# EAGLE design RevA (EAGLE 7.3.0)
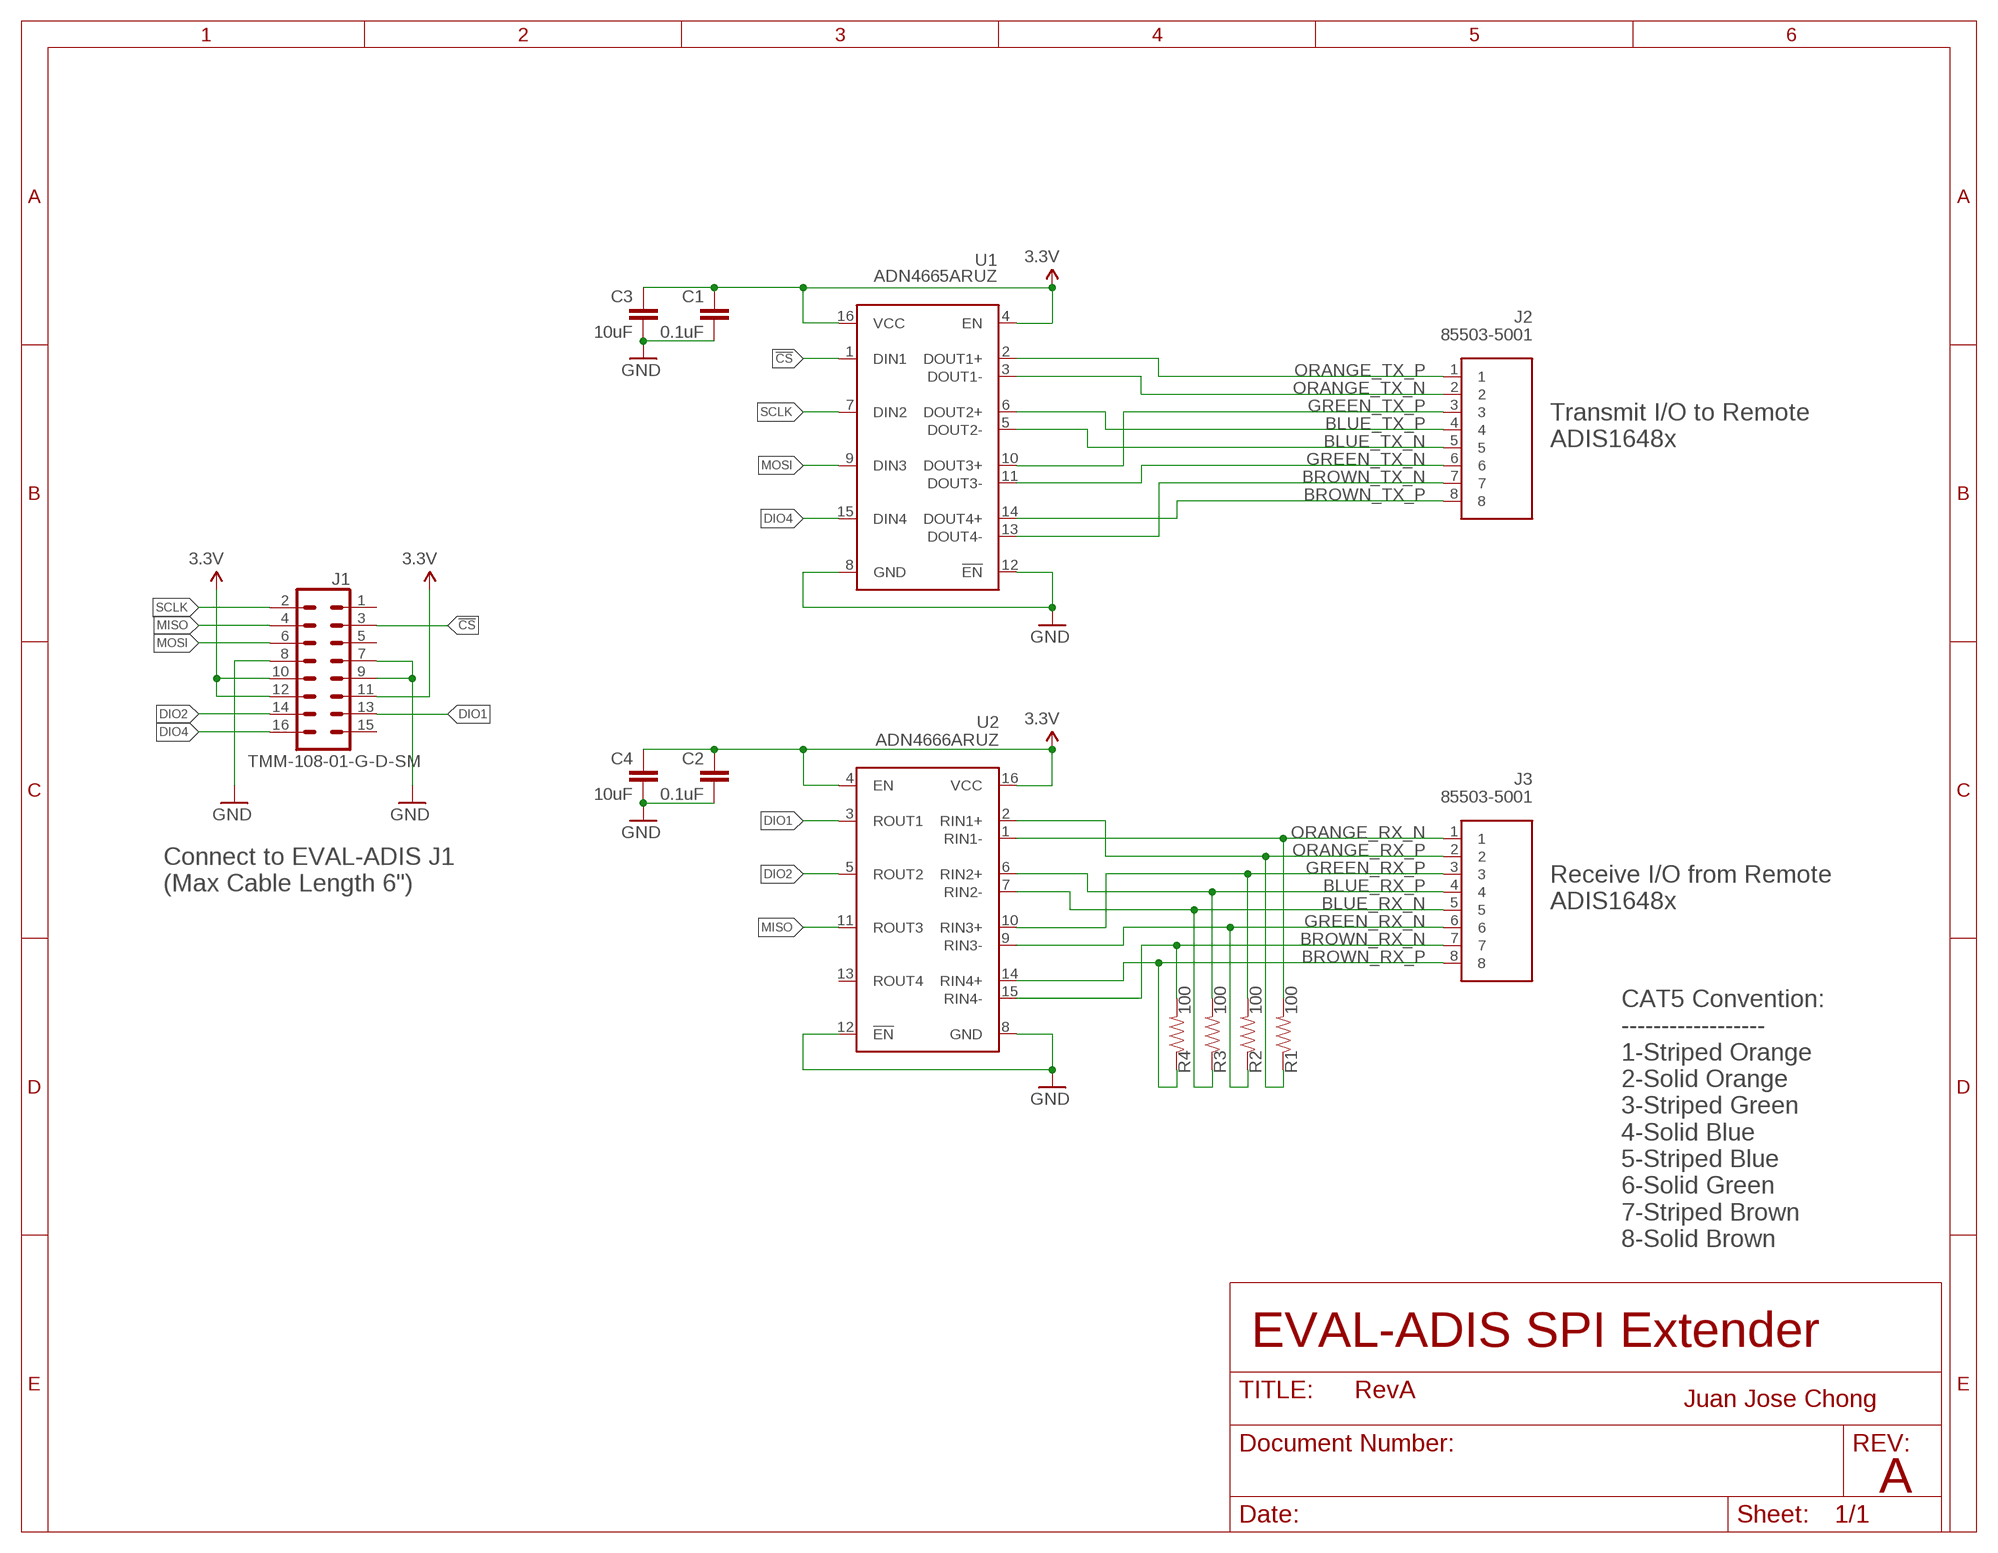
[diagram p0: schematic, sheet 1]

## Parts
C1  0.1uF  CAP0805  [0805]
C2  0.1uF  CAP0805  [0805]
C3  10uF  CAP1206  [1206]
C4  10uF  CAP1206  [1206]
J1  TMM-108-01-G-D-SM  TMM-108-XX-X-D  [TMM-108-XX-X-D]
J2  85503-5001  [85503-5001]
J3  85503-5001  [85503-5001]
R1  100  RESISTOR0603-RES  [0603-RES]
R2  100  RESISTOR0603-RES  [0603-RES]
R3  100  RESISTOR0603-RES  [0603-RES]
R4  100  RESISTOR0603-RES  [0603-RES]
U1  ADN4665ARUZ  [TSSOP-16]
U2  ADN4666ARUZ  [TSSOP-16]

## Nets
3.3V: C1.1 C2.1 C3.1 C4.1 J1.10 J1.11 J1.12 U1.4(EN) U1.16(VCC) U2.4(EN) U2.16(VCC)
!CS: J1.3 U1.1(DIN1)
BLUE_RX_N: J3.5 R3.1 U2.7(RIN2-)
BLUE_RX_P: J3.4 R3.2 U2.6(RIN2+)
BLUE_TX_N: J2.5 U1.5(DOUT2-)
BLUE_TX_P: J2.4 U1.6(DOUT2+)
BROWN_RX_N: J3.7 R4.2 U2.15(RIN4-)
BROWN_RX_P: J3.8 R4.1 U2.14(RIN4+)
BROWN_TX_N: J2.7 U1.13(DOUT4-)
BROWN_TX_P: J2.8 U1.14(DOUT4+)
DIO1: J1.13 U2.3(ROUT1)
DIO2: J1.14 U2.5(ROUT2)
DIO4: J1.16 U1.15(DIN4)
GND: C1.2 C2.2 C3.2 C4.2 J1.7 J1.8 J1.9 U1.8(GND) U1.12(!EN) U2.8(GND) U2.12(!EN)
GREEN_RX_N: J3.6 R2.1 U2.9(RIN3-)
GREEN_RX_P: J3.3 R2.2 U2.10(RIN3+)
GREEN_TX_N: J2.6 U1.11(DOUT3-)
GREEN_TX_P: J2.3 U1.10(DOUT3+)
MISO: J1.4 U2.11(ROUT3)
MOSI: J1.6 U1.9(DIN3)
ORANGE_RX_N: J3.1 R1.2 U2.1(RIN1-)
ORANGE_RX_P: J3.2 R1.1 U2.2(RIN1+)
ORANGE_TX_N: J2.2 U1.3(DOUT1-)
ORANGE_TX_P: J2.1 U1.2(DOUT1+)
SCLK: J1.2 U1.7(DIN2)
Unconnected: J1.1 J1.5 J1.15 U2.13(ROUT4)

## Notes on the sheet
- Transmit I/O to Remote
  ADIS1648x
- Connect to EVAL-ADIS J1
  (Max Cable Length 6")
- Receive I/O from Remote
  ADIS1648x
- CAT5 Convention:
  ------------------
  1-Striped Orange
  2-Solid Orange
  3-Striped Green
  4-Solid Blue
  5-Striped Blue
  6-Solid Green
  7-Striped Brown
  8-Solid Brown
- EVAL-ADIS SPI Extender
- Juan Jose Chong
- A

## Library data of the parts
C1 C2 = SparkFun-Passives:CAP: Capacitor Standard 0603 ceramic capacitor, and 0.1" leaded capacitor.; PARTNO: CL10B104KB8NNNC
C3 C4 = SparkFun-Passives:CAP: Capacitor Standard 0603 ceramic capacitor, and 0.1" leaded capacitor.; PARTNO: F931C106MAA
J1 = con-samtec-tmm:TMM-108-XX-X-D: HEADER; PARTNO: TMM-108-01-G-D-SM
J2 J3 = AnalogDevices:85503-5001; PARTNO: 855035001
R1-R4 = SparkFun-Passives:RESISTOR: Resistor Basic schematic elements and footprints for 0603, 1206, and PTH resistors.; PARTNO: ERJ-3EKF1000V
U1 = Analog Devices iSensors:ADN4665; PARTNO: ADN4665ARUZ
U2 = Analog Devices iSensors:ADN4666; PARTNO: ADN4666ARUZ

## Board
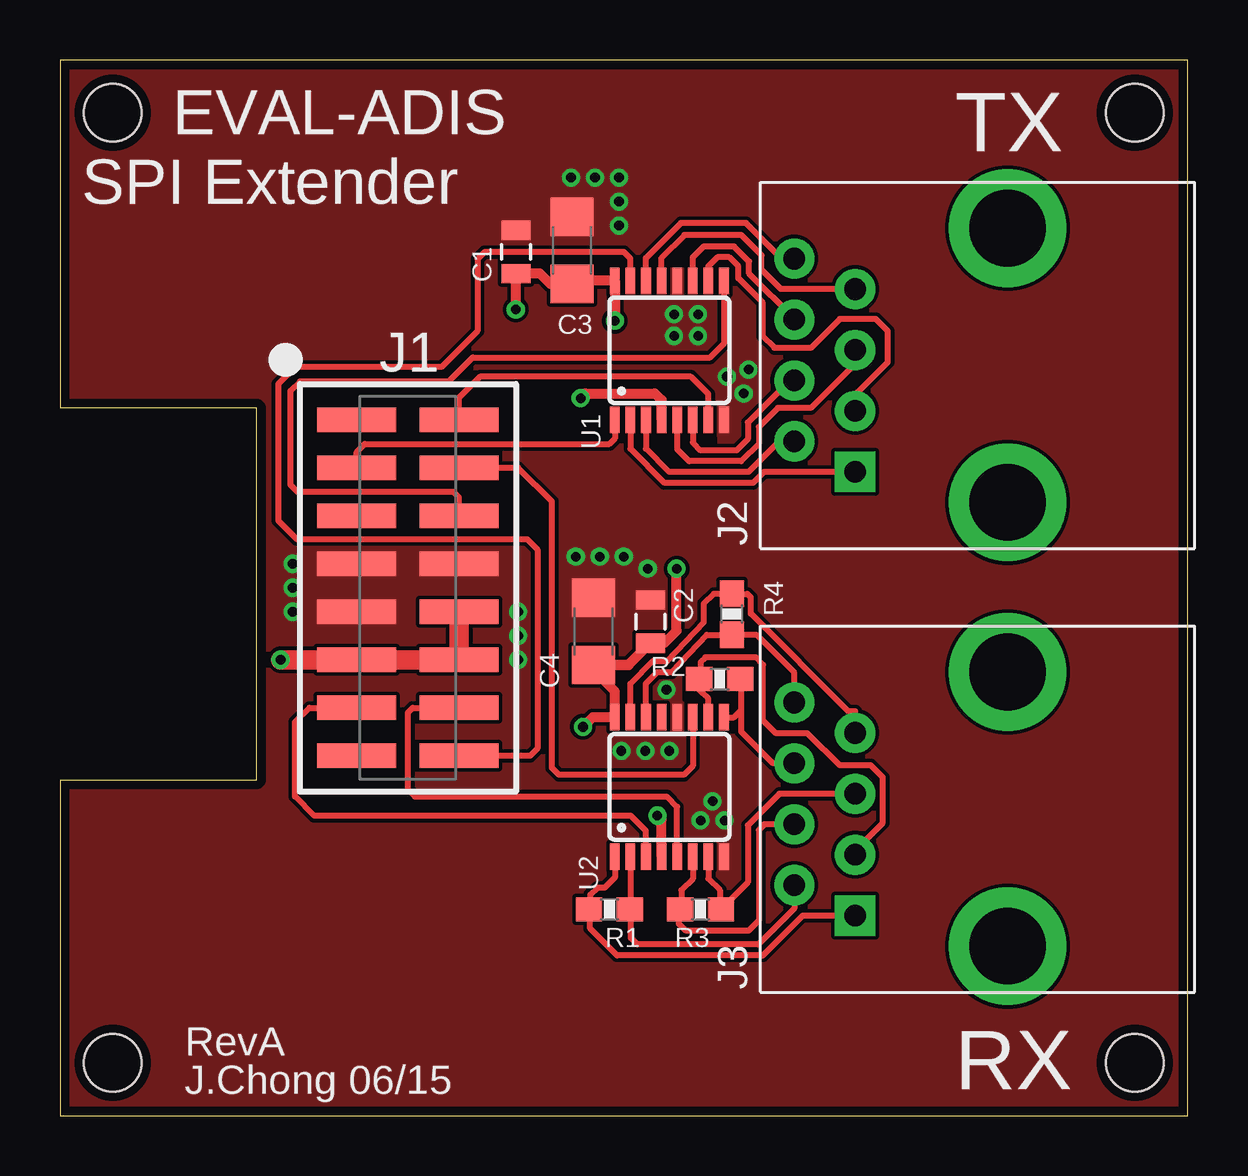
[diagram p1: board, top side]
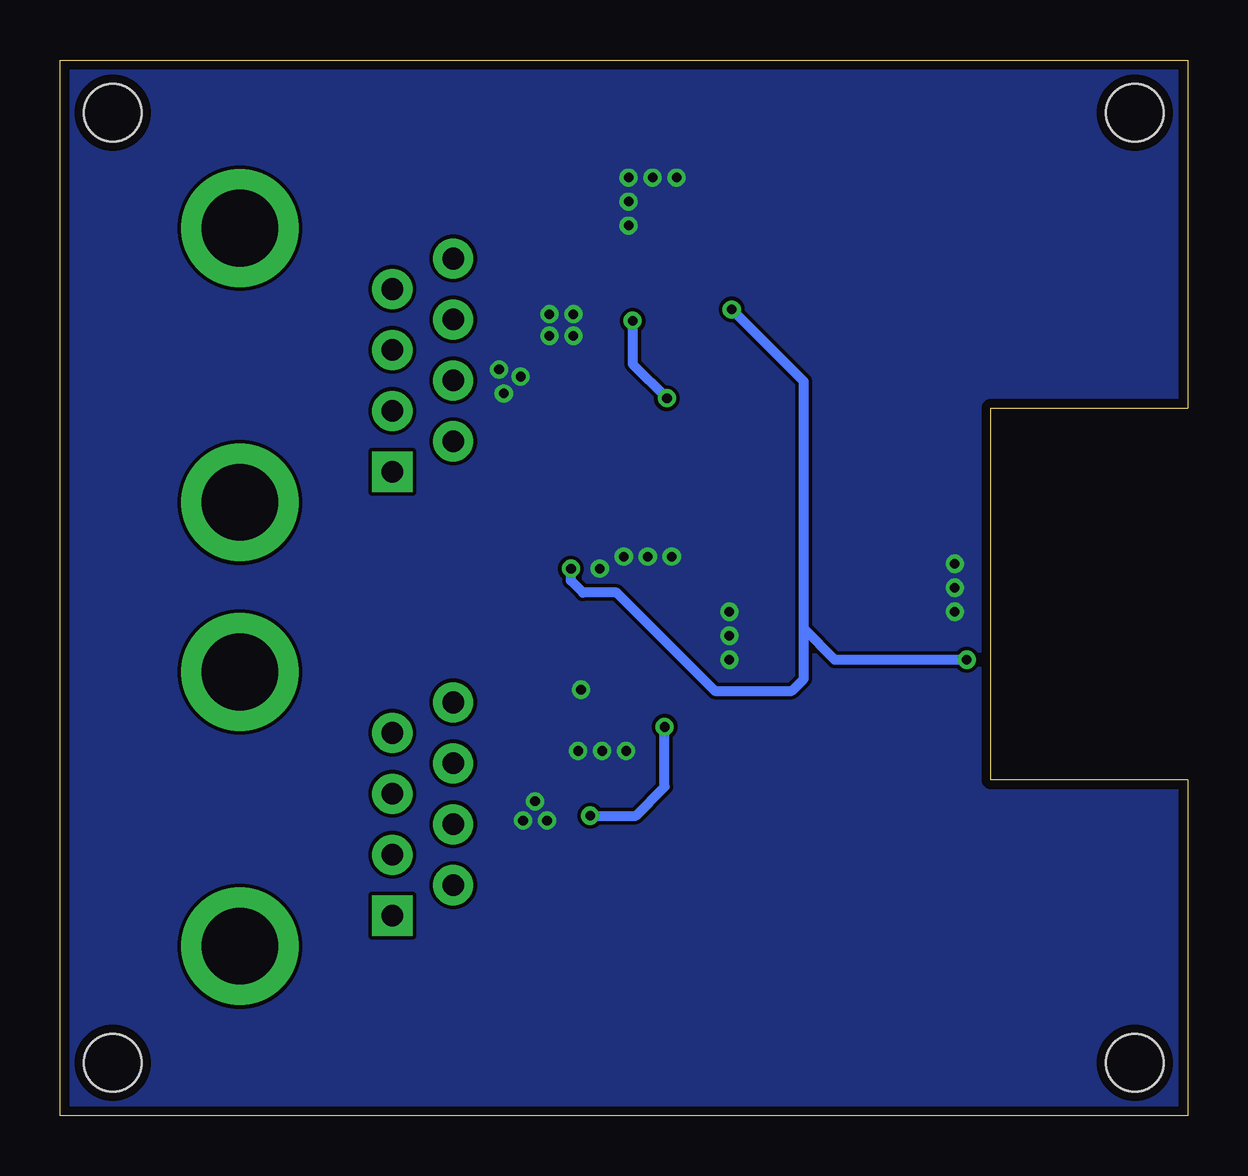
[diagram p2: board, bottom side, seen from below]

Size 47 x 44 mm. Coordinates in mm from the lower left corner, seen from the top.
Outline: 0,0 47,0 47,44 0,44 0,29.5 8.2,29.5 8.2,14 0,14 0,0
Copper layers (1*16): Top 0.0356mm / dielectric 1.5011mm / Bottom 0.0356mm
Design rules "LaenPCBOrder": minimum track width 6mil, minimum drill 13mil, track to track 6mil, track to pad 6mil, pad to pad 6mil, via to via 6mil, smd to smd 6mil, copper to edge 15mil, drill to drill 6mil, minimum pad ring 7mil, minimum via ring 7mil, stop-mask expansion 4mil, vias tented up to drill 0mil, thermal gap 10mil
Holes 2.4 mm at 2.2,2.2 44.8,2.2 44.8,41.8 2.2,41.8
tRestrict: 5 lines

### Footprints (pad centres in the part's own frame; a part is rotated, then mirrored left to right if it is on the bottom)
0805 = smd 0.8 x 1.2: 1 -0.9,0; 2 0.9,0
1206 = smd 1.6 x 1.8: 1 -1.4,0; 2 1.4,0
TMM-108-XX-X-D = smd 1.02 x 3.3: 1 -7,-2.134; 2 -7,2.134; 3 -5,-2.134; 4 -5,2.134; 5 -3,-2.134; 6 -3,2.134; 7 -1,-2.134; 8 -1,2.134; 9 1,-2.134; 10 1,2.134; 11 3,-2.134; 12 3,2.134; 13 5,-2.134; 14 5,2.134; 15 7,-2.134; 16 7,2.134
85503-5001 = drill 0.9 pad 1.676 square: 1 0,0 | drill 0.9 pad 1.676: 2 1.27,2.54; 3 2.54,0; 4 3.81,2.54; 5 5.08,0; 6 6.35,2.54; 7 7.62,0; 8 8.89,2.54 | drill 3.2 pad 4.9: P$1 -1.27,-6.35; P$2 10.16,-6.35
0603-RES = smd 1.1 x 1: 1 -0.85,0; 2 0.85,0
TSSOP-16 = smd 0.4 x 1.1: 1 -2.275,-2.9; 2 -1.625,-2.9; 3 -0.975,-2.9; 4 -0.325,-2.9; 5 0.325,-2.9; 6 0.975,-2.9; 7 1.625,-2.9; 8 2.275,-2.9; 9 2.275,2.9; 10 1.625,2.9; 11 0.975,2.9; 12 0.325,2.9; 13 -0.325,2.9; 14 -0.975,2.9; 15 -1.625,2.9; 16 -2.275,2.9

### Placement (x,y rotation side)
C1  19.01,36 90 top
C2  24.61,20.59 90 top
C3  21.34,36.06 90 top
C4  22.24,20.18 90 top
J1  14.5,22 270 top
J2  33.15,26.83 90 top
J3  33.15,8.33 90 top
R1  22.9,8.6 180 top
R2  27.5,18.2 180 top
R3  26.7,8.6 180 top
R4  28,20.9 90 top
U1  25.4,31.9 0 top
U2  25.4,13.7 0 top

### Tracks (layer width: path | path; a pad name or v marks a point on that pad's centre or on a via)
3.3V  (via drill 0.4)
  Top 0.406: v23.13,33.13 v23.12,33.13 U1.16 21.48,34.8 C3.1 20.44,34.66 20,35.1 C1.1 v19,33.6 | v21.7,29.9 21.9,30.1 24.8,30.1 25.07,29.82 U1.4 | 22.68,18.78 C4.1 23.68,18.78 C2.1 25.2,19.7 25.7,20.2 v25.7,22.8 | C2.1 23.7,18.78 22.68,18.78 | 22.68,18.78 22.3,18.4 22.4,18.4 23.12,17.68 U2.16 22.2,16.6 v21.8,16.2 | U2.4 25.07,12.32 v24.9,12.5
  Top 0.813: 16.6,19 J1.12 J1.10 16.63,19.03 16.6,19 | 16.6,19 J1.11 v9.2,19
  Bottom 0.406: v23.13,33.13 23.13,31.33 v21.7,29.9 | v9.2,19 14.7,19 16,20.3 | 16,20.3 16,30.6 v19,33.6 | 16,20.3 16,18.2 16.5,17.7 19.7,17.7 23.8,21.8 25.2,21.8 25.7,22.3 v25.7,22.8 | v24.9,12.5 23,12.5 21.8,13.7 v21.8,16.2
!CS
  Top 0.254: J1.3 12.37,27.67 12.7,28 22.9,28 23.12,28.23 U1.1
BLUE_RX_N
  Top 0.254: J3.5 29.99,13.41 28.67,12.1 28.67,9.72 R3.1 27.5,8.65 27.5,9.4 27.02,9.88 U2.7
BLUE_RX_P
  Top 0.254: J3.4 29.36,12.14 29.13,11.9 29.13,8.13 28.7,7.7 26.1,7.7 25.8,8 25.8,8.55 R3.2 25.9,8.65 25.9,9.4 26.38,9.88 U2.6
BLUE_TX_N
  Top 0.254: J2.5 33.15,31.35 31.3,29.5 29.92,29.5 29.13,28.7 29.13,28 28.39,27.27 26.23,27.27 25.73,27.77 U1.5
BLUE_TX_P
  Top 0.254: J2.4 30.42,30.64 28.67,28.89 28.67,28.2 28.2,27.73 26.7,27.73 26.38,28.05 U1.6
BROWN_RX_N
  Top 0.152: 23.77,17.2 U2.15
  Top 0.254: J3.7 33.15,16.85 32.87,16.85 28.8,20.92 28.8,21.6 28.65,21.75 R4.2 27.25,21.75 26.84,21.34 26.84,20.56 25.3,18.93 24.7,18.93 23.77,18 23.77,17.2
BROWN_RX_P
  Top 0.152: 24.43,17.2 U2.14
  Top 0.254: J3.8 30.61,18.47 29.03,20.05 R4.1 27.99,20.04 26.96,20.04 25.5,18.47 24.89,18.47 24.43,18 24.43,17.2
BROWN_TX_N
  Top 0.254: J2.7 30.05,34.45 29.24,35.26 29.24,35.86 28.4,36.7 26.02,36.7 25.07,35.75 U1.13
BROWN_TX_P
  Top 0.254: J2.8 30.08,35.72 28.6,37.2 25.88,37.2 24.43,35.75 U1.14
DIO1
  Top 0.254: U2.3 24.43,11.88 23.8,12.5 10.6,12.5 9.8,13.3 9.8,16.4 10.4,17 J1.13
DIO2
  Top 0.254: U2.5 25.73,12.88 25.3,13.3 14.8,13.3 14.5,13.6 14.5,16.8 14.7,17 J1.14
DIO4
  Top 0.254: U1.15 23.77,35.73 23.5,36 17.7,36 17.4,35.7 17.4,32.7 15.9,31.2 9.8,31.2 9.1,30.5 9.1,24.8 9.87,24.03 19.47,24.03 19.9,23.6 19.9,15.3 19.6,15 J1.16
GND  (via drill 0.4)
  other vias: 26.6,33.4 26.6,32.5 25.6,33.4 25.6,32.5 19.1,21 9.7,21 9.7,22 9.7,23 23.3,37.1 23.3,38.1 23.3,39.1 22.3,39.1 21.3,39.1 27.8,30.8 28.5,30.1 28.7,31.1 19.1,20 19.1,19 26.7,12.3 27.7,12.3 27.2,13.1 25.4,15.2 24.4,15.2 23.4,15.2 21.5,23.3 22.5,23.3 23.5,23.3 24.5,22.8 25.28,17.75
  pour Top (no thermals): 0,44 0,0 47,0 47,44
  pour Bottom: 0,44 0,0 47,0 47,44
GREEN_RX_N
  Top 0.254: J3.6 29.72,14.68 28.4,16 28.4,16.9 | 28.4,16.9 28.4,18.15 R2.1 | U2.9 28.1,16.6 28.4,16.9
GREEN_RX_P
  Top 0.254: J3.3 33.15,11.05 34.3,12.2 34.3,14.1 33.8,14.6 32.5,14.6 31.15,15.93 29.85,15.93 29.31,16.47 29.31,18.79 29,19.1 26.9,19.1 26.7,18.9 26.7,18.25 R2.2 26.65,17.75 26.8,17.6 27,17.4 27.02,17.38 U2.10
GREEN_TX_N
  Top 0.254: J2.6 30.61,33.21 28.73,35.09 28.73,35.59 28.09,36.23 26.83,36.23 26.38,35.77 U1.11
GREEN_TX_P
  Top 0.254: J2.3 33.15,30.05 34.5,31.4 34.5,32.7 34,33.2 32.5,33.2 31.3,32 29.78,32 29.78,32.02 29.3,32.5 29.3,33.88 28.27,34.91 28.27,35.41 27.91,35.77 27.4,35.77 27.02,35.4 U1.10
MISO
  Top 0.254: U2.11 26.38,14.57 26,14.2 20.8,14.2 20.5,14.5 20.5,25.6 19.1,27 J1.4
MOSI
  Top 0.254: U1.9 27.68,32.17 27.1,31.6 17.2,31.6 16.2,30.6 10,30.6 9.6,30.2 9.6,26.3 9.9,26 16.4,26 16.63,25.77 J1.6
ORANGE_RX_N
  Top 0.254: J3.1 30.95,8.33 29.3,6.67 23.23,6.67 22.1,7.8 22.1,8.55 R1.2 22.1,8.65 22.1,9.2 22.4,9.5 22.7,9.5 23.12,9.93 U2.1
ORANGE_RX_P
  Top 0.254: J3.2 30.61,8.63 29.11,7.13 24.07,7.13 23.8,7.4 23.8,8.55 R1.1 23.77,8.62 U2.2
ORANGE_TX_N
  Top 0.254: J2.2 29.98,28.1 28.7,26.83 25.39,26.83 24.43,27.8 U1.3
ORANGE_TX_P
  Top 0.254: J2.1 29.35,26.83 28.89,26.37 25.2,26.37 23.77,27.8 U1.2
SCLK
  Top 0.254: U1.7 27.02,30.07 26.3,30.8 17.5,30.8 16.63,29.93 J1.2

### Text on the board
tNames: EVAL-ADIS | TX | SPI Extender | RevA | J.Chong 06/15 | RX